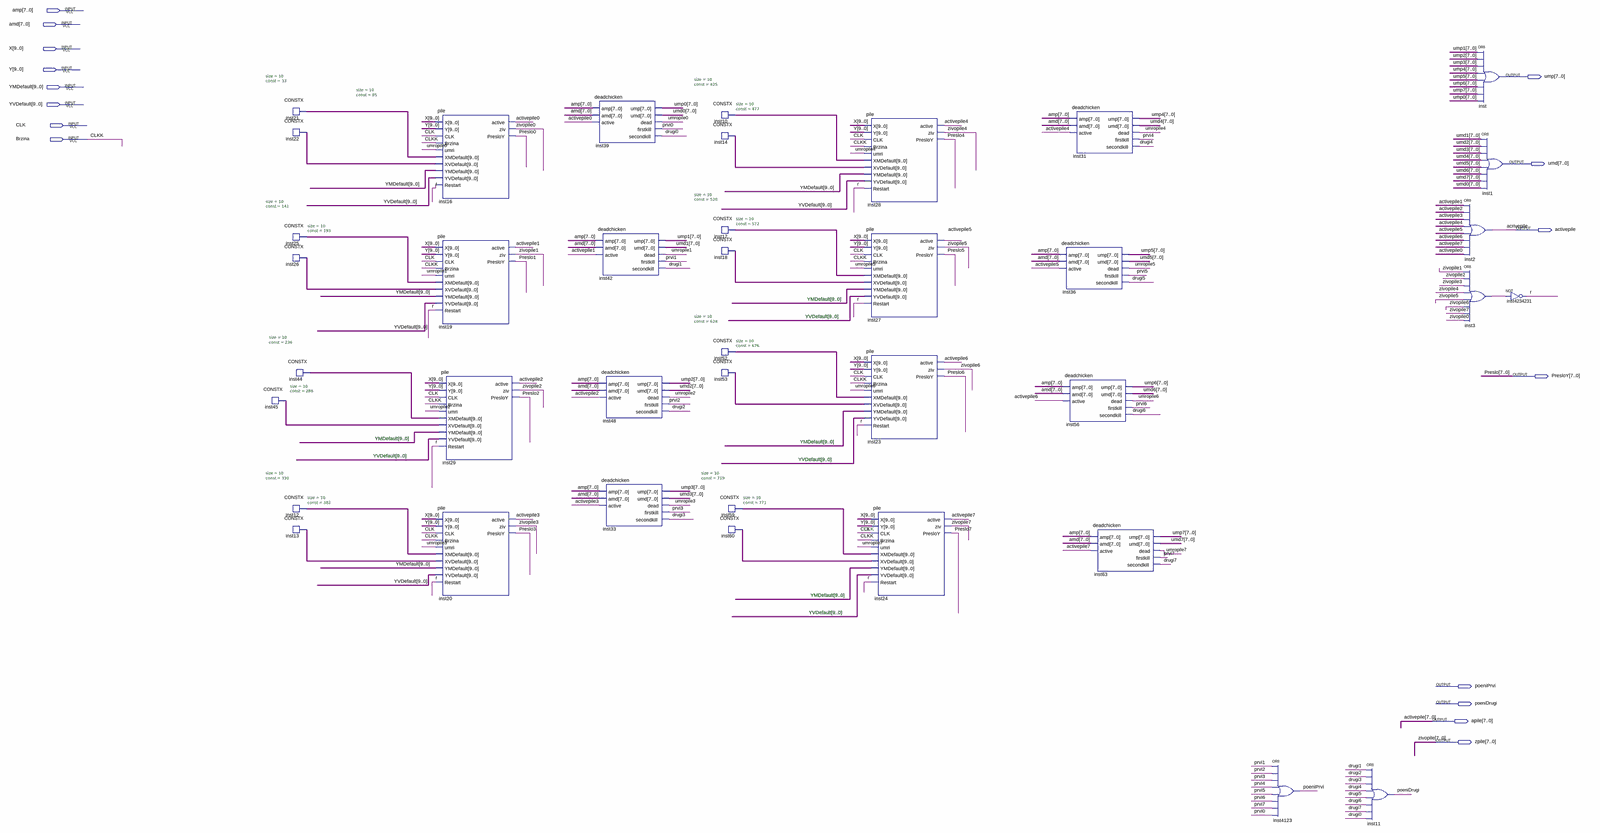
[diagram p0: schematic sheet, whole]
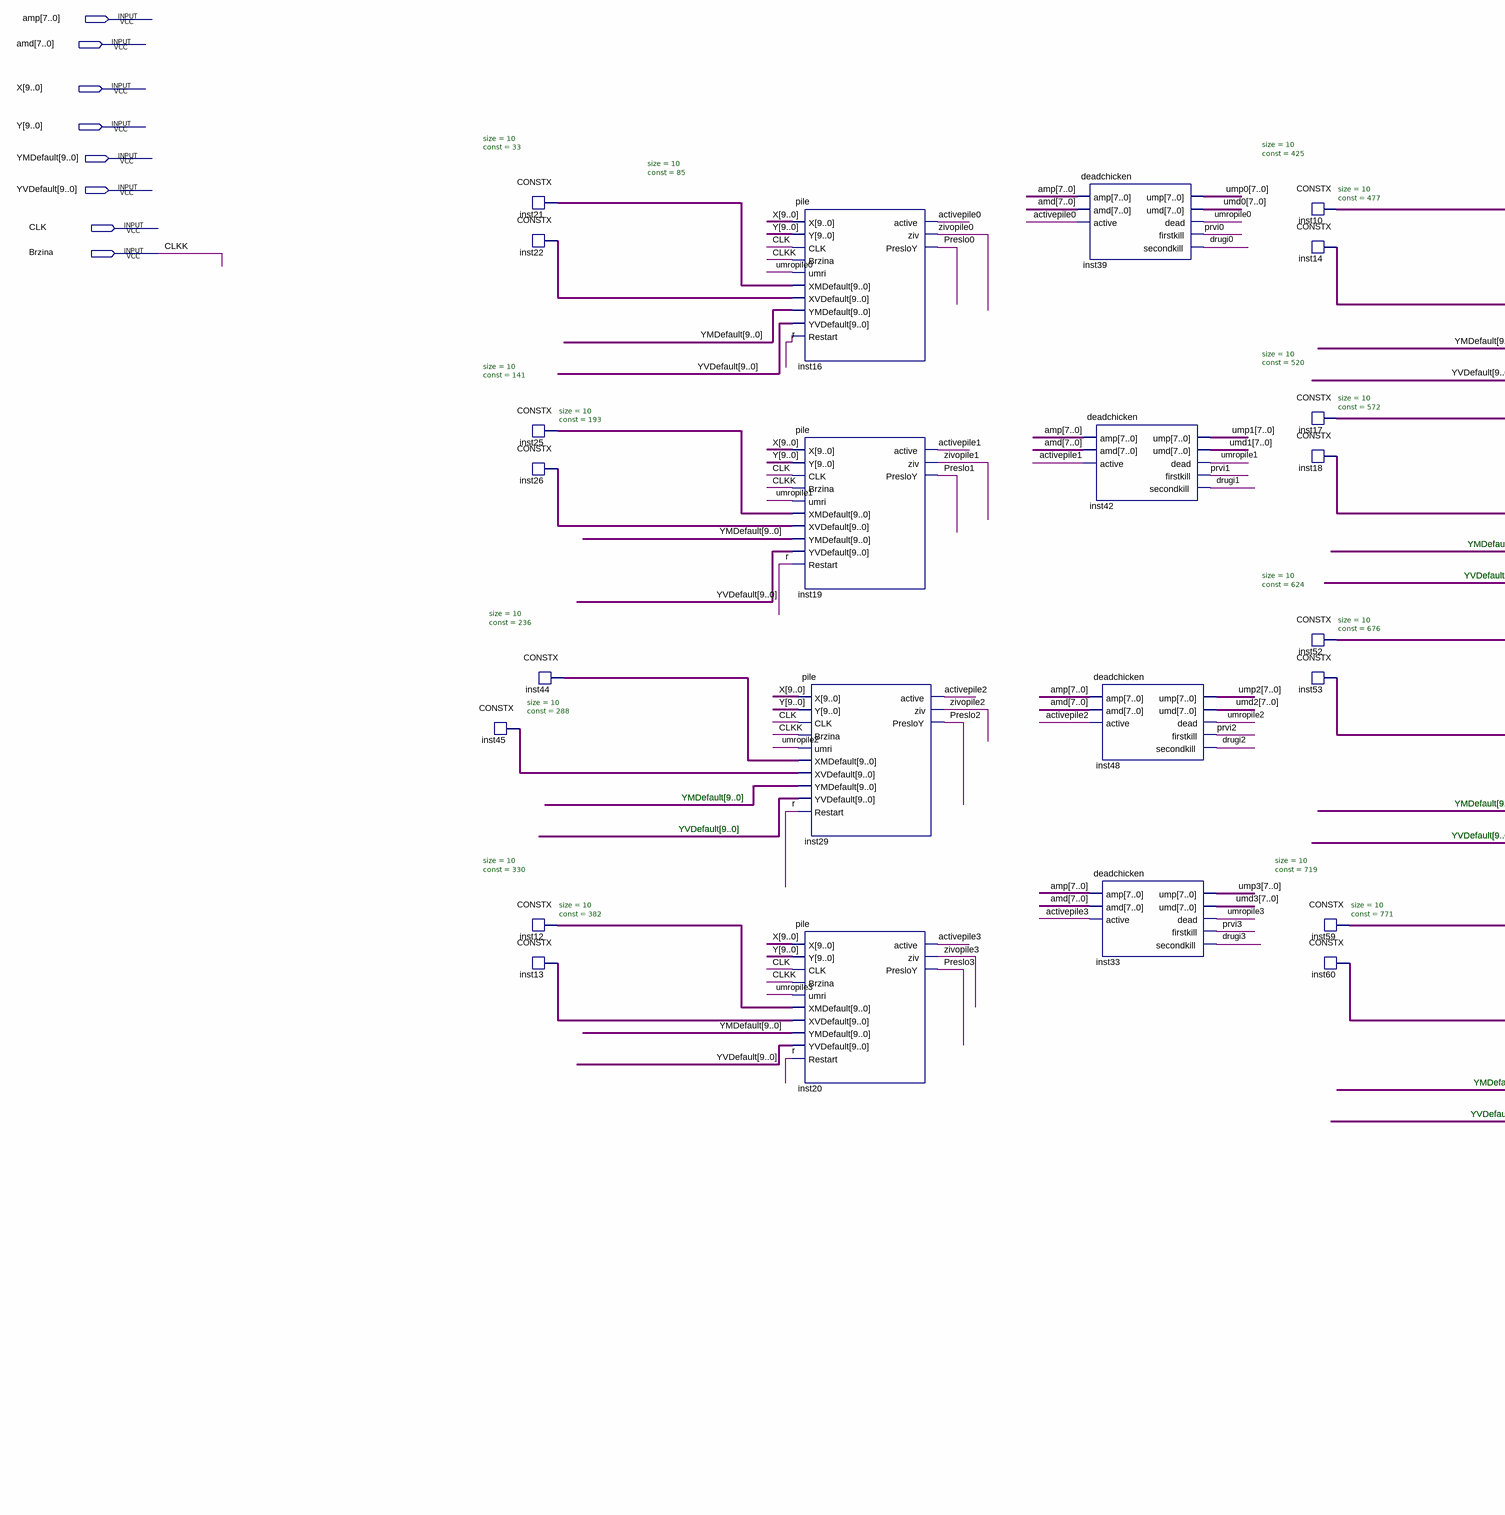
[diagram p1: schematic sheet, left part]
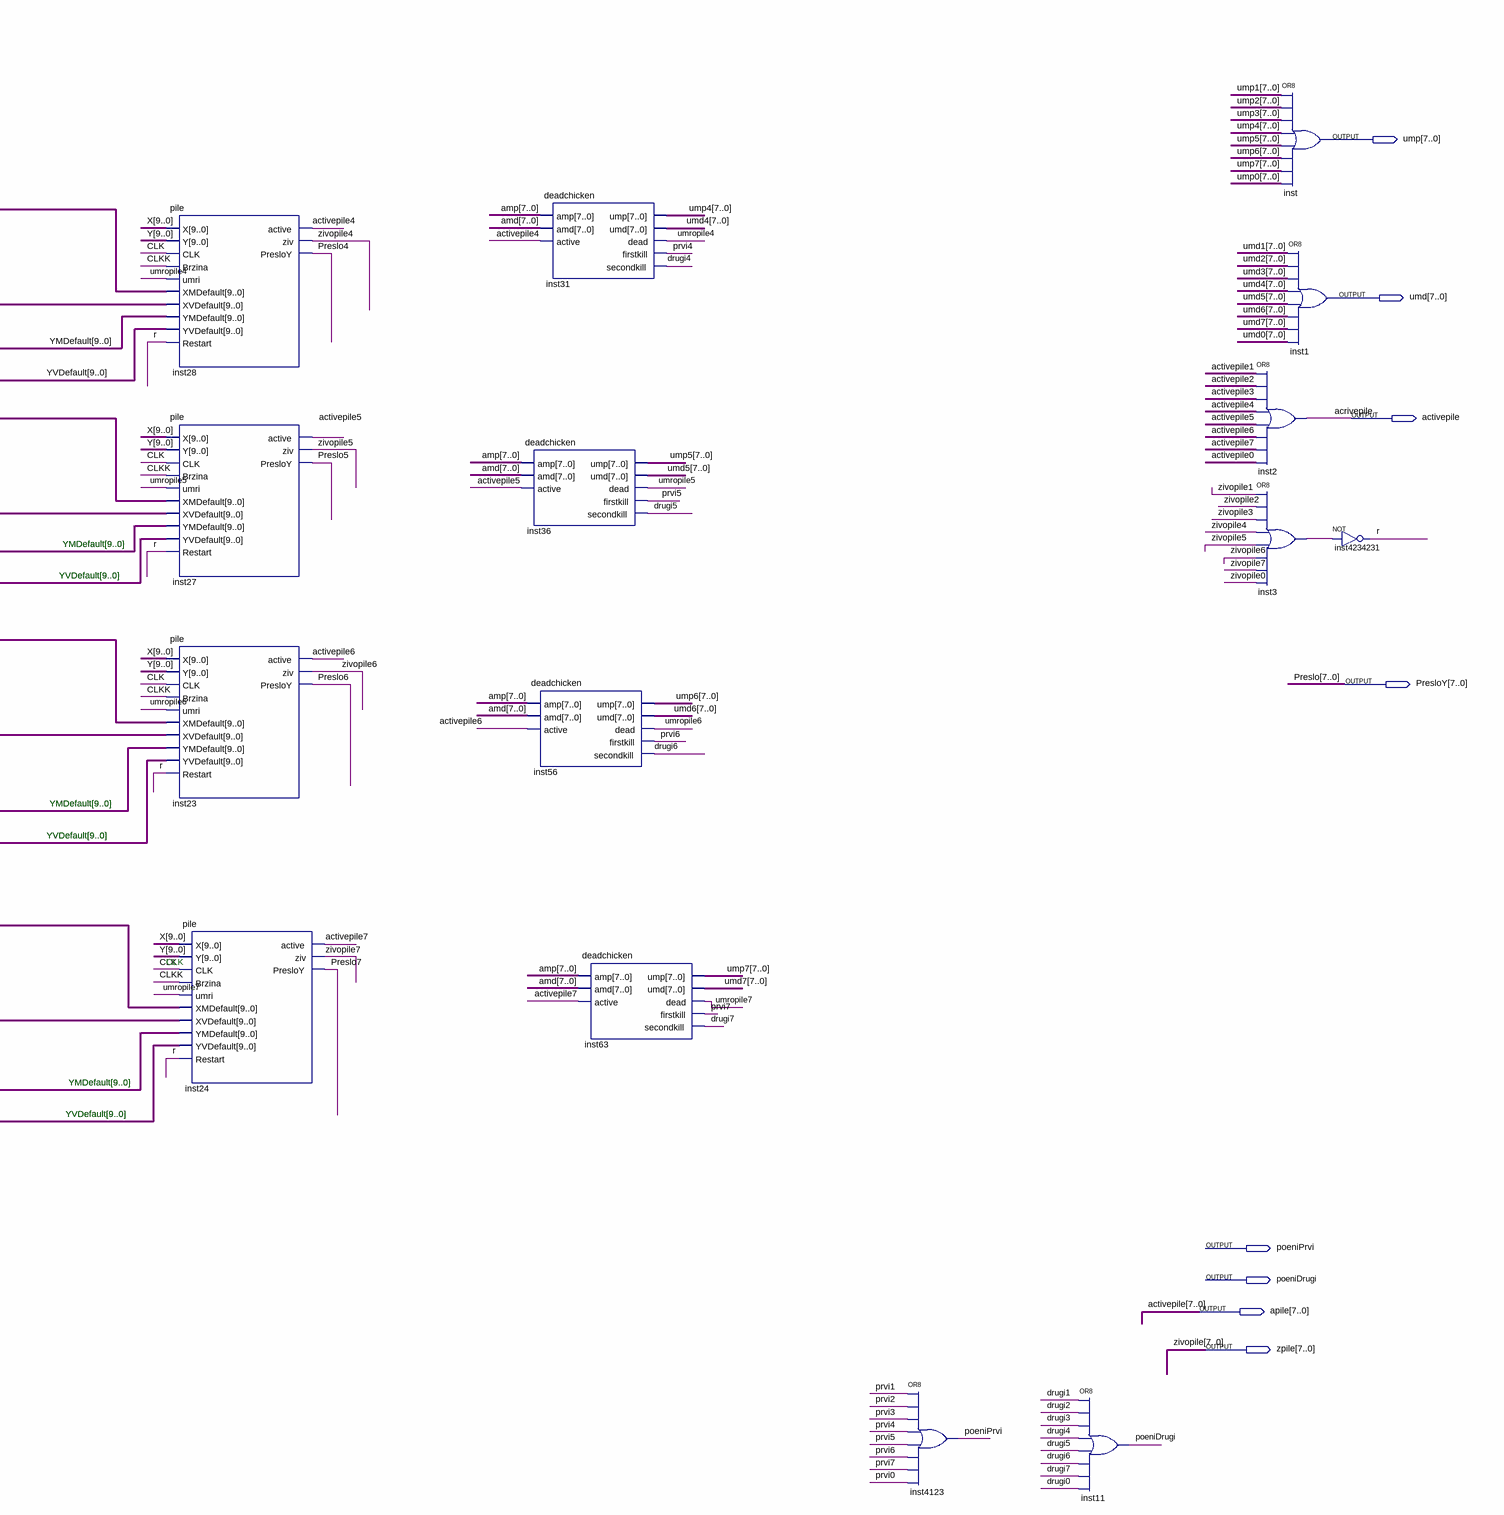
[diagram p2: schematic sheet, right part]
// Quartus schematic Pilici.bdf as structural Verilog: 39 symbols, 16 pins
module Pilici (
  input  [7:0] amp,
  input  [7:0] amd,
  input  [9:0] X,
  input  [9:0] Y,
  input  [9:0] YMDefault,
  input  [9:0] YVDefault,
  input  CLK,
  input  Brzina,
  output [7:0] ump,
  output [7:0] umd,
  output activepile,
  output [7:0] PresloY,
  output poeniPrvi,
  output poeniDrugi,
  output [7:0] apile,
  output [7:0] zpile
);

  wire drugi0, drugi1, drugi2, drugi3, drugi4, drugi5, drugi6, drugi7, inst3_out, prvi0, prvi1, prvi2, prvi3,
       prvi4, prvi5, prvi6, prvi7, r, umropile0, umropile1, umropile2, umropile3, umropile4, umropile5,
       umropile6, umropile7;
  wire [7:0] umd0, umd1, umd2, umd3, umd4, umd5, umd6, umd7, ump0, ump1, ump2, ump3, ump4, ump5, ump6, ump7;
  wire [9:0] inst10_data, inst12_data, inst13_data, inst14_data, inst17_data, inst18_data, inst21_data,
       inst22_data, inst25_data, inst26_data, inst44_data, inst45_data, inst52_data, inst53_data,
       inst59_data, inst60_data;

  CONSTX #(.size(10), .\const (288)) inst45 (.data(inst45_data));
  CONSTX #(.size(10), .\const (33)) inst21 (.data(inst21_data));
  CONSTX #(.size(10), .\const (85)) inst22 (.data(inst22_data));
  CONSTX #(.size(10), .\const (141)) inst25 (.data(inst25_data));
  CONSTX #(.size(10), .\const (193)) inst26 (.data(inst26_data));
  CONSTX #(.size(10), .\const (236)) inst44 (.data(inst44_data));
  CONSTX #(.size(10), .\const (330)) inst12 (.data(inst12_data));
  CONSTX #(.size(10), .\const (382)) inst13 (.data(inst13_data));
  pile inst16 (
    .X(X), .Y(Y), .CLK(CLK), .Brzina(Brzina), .umri(umropile0), .XMDefault(inst21_data),
    .XVDefault(inst22_data), .YMDefault(YMDefault), .YVDefault(YVDefault), .Restart(r), .active(apile[0]),
    .ziv(zpile[0]), .PresloY(PresloY[0]));
  pile inst19 (
    .X(X), .Y(Y), .CLK(CLK), .Brzina(Brzina), .umri(umropile1), .XMDefault(inst25_data),
    .XVDefault(inst26_data), .YMDefault(YMDefault), .YVDefault(YVDefault), .Restart(r), .active(apile[1]),
    .ziv(zpile[1]), .PresloY(PresloY[1]));
  pile inst29 (
    .X(X), .Y(Y), .CLK(CLK), .Brzina(Brzina), .umri(umropile2), .XMDefault(inst44_data),
    .XVDefault(inst45_data), .YMDefault(YMDefault), .YVDefault(YVDefault), .Restart(r), .active(apile[2]),
    .ziv(zpile[2]), .PresloY(PresloY[2]));
  pile inst20 (
    .X(X), .Y(Y), .CLK(CLK), .Brzina(Brzina), .umri(umropile3), .XMDefault(inst12_data),
    .XVDefault(inst13_data), .YMDefault(YMDefault), .YVDefault(YVDefault), .Restart(r), .active(apile[3]),
    .ziv(zpile[3]), .PresloY(PresloY[3]));
  deadchicken inst39 (
    .amp(amp), .amd(amd), .active(apile[0]), .ump(ump0), .umd(umd0), .dead(umropile0), .firstkill(prvi0),
    .secondkill(drugi0));
  deadchicken inst42 (
    .amp(amp), .amd(amd), .active(apile[1]), .ump(ump1), .umd(umd1), .dead(umropile1), .firstkill(prvi1),
    .secondkill(drugi1));
  deadchicken inst48 (
    .amp(amp), .amd(amd), .active(apile[2]), .ump(ump2), .umd(umd2), .dead(umropile2), .firstkill(prvi2),
    .secondkill(drugi2));
  deadchicken inst33 (
    .amp(amp), .amd(amd), .active(apile[3]), .ump(ump3), .umd(umd3), .dead(umropile3), .firstkill(prvi3),
    .secondkill(drugi3));
  CONSTX #(.size(10), .\const (425)) inst10 (.data(inst10_data));
  CONSTX #(.size(10), .\const (477)) inst14 (.data(inst14_data));
  CONSTX #(.size(10), .\const (520)) inst17 (.data(inst17_data));
  CONSTX #(.size(10), .\const (572)) inst18 (.data(inst18_data));
  CONSTX #(.size(10), .\const (624)) inst52 (.data(inst52_data));
  CONSTX #(.size(10), .\const (676)) inst53 (.data(inst53_data));
  CONSTX #(.size(10), .\const (719)) inst59 (.data(inst59_data));
  CONSTX #(.size(10), .\const (771)) inst60 (.data(inst60_data));
  pile inst28 (
    .X(X), .Y(Y), .CLK(CLK), .Brzina(Brzina), .umri(umropile4), .XMDefault(inst10_data),
    .XVDefault(inst14_data), .YMDefault(YMDefault), .YVDefault(YVDefault), .Restart(r), .active(apile[4]),
    .ziv(zpile[4]), .PresloY(PresloY[4]));
  pile inst27 (
    .X(X), .Y(Y), .CLK(CLK), .Brzina(Brzina), .umri(umropile5), .XMDefault(inst17_data),
    .XVDefault(inst18_data), .YMDefault(YMDefault), .YVDefault(YVDefault), .Restart(r), .active(apile[5]),
    .ziv(zpile[5]), .PresloY(PresloY[5]));
  pile inst23 (
    .X(X), .Y(Y), .CLK(CLK), .Brzina(Brzina), .umri(umropile6), .XMDefault(inst52_data),
    .XVDefault(inst53_data), .YMDefault(YMDefault), .YVDefault(YVDefault), .Restart(r), .active(apile[6]),
    .ziv(zpile[6]), .PresloY(PresloY[6]));
  pile inst24 (
    .X(X), .Y(Y), .CLK(CLK), .Brzina(Brzina), .umri(umropile7), .XMDefault(inst59_data),
    .XVDefault(inst60_data), .YMDefault(YMDefault), .YVDefault(YVDefault), .Restart(r), .active(apile[7]),
    .ziv(zpile[7]), .PresloY(PresloY[7]));
  deadchicken inst36 (
    .amp(amp), .amd(amd), .active(apile[5]), .ump(ump5), .umd(umd5), .dead(umropile5), .firstkill(prvi5),
    .secondkill(drugi5));
  deadchicken inst31 (
    .amp(amp), .amd(amd), .active(apile[4]), .ump(ump4), .umd(umd4), .dead(umropile4), .firstkill(prvi4),
    .secondkill(drugi4));
  deadchicken inst56 (
    .amp(amp), .amd(amd), .active(apile[6]), .ump(ump6), .umd(umd6), .dead(umropile6), .firstkill(prvi6),
    .secondkill(drugi6));
  deadchicken inst63 (
    .amp(amp), .amd(amd), .active(apile[7]), .ump(ump7), .umd(umd7), .dead(umropile7), .firstkill(prvi7),
    .secondkill(drugi7));
  or inst4123 (poeniPrvi, prvi1, prvi2, prvi3, prvi4, prvi5, prvi6, prvi7, prvi0);
  or inst11 (poeniDrugi, drugi1, drugi2, drugi3, drugi4, drugi5, drugi6, drugi7, drugi0);
  assign ump = ump1 | ump2 | ump3 | ump4 | ump5 | ump6 | ump7 | ump0;  // OR8 inst, 8 bits wide
  or inst2 (activepile, apile[1], apile[2], apile[3], apile[4], apile[5], apile[6], apile[7], apile[0]);
  or inst3 (inst3_out, zpile[1], zpile[2], zpile[3], zpile[4], zpile[5], zpile[6], zpile[7], zpile[0]);
  assign umd = umd1 | umd2 | umd3 | umd4 | umd5 | umd6 | umd7 | umd0;  // OR8 inst1, 8 bits wide
  not inst4234231 (r, inst3_out);

  // Other names for the same wires on the sheet: acrivepile = activepile; activepile[7:0] = apile;
  //   activepile0 = apile[0]; activepile1 = apile[1]; activepile2 = apile[2]; activepile3 = apile[3];
  //   activepile4 = apile[4]; activepile5 = apile[5]; activepile6 = apile[6]; activepile7 = apile[7]; CLKK = Brzina;
  //   Preslo[7:0] = PresloY; Preslo0 = PresloY[0]; Preslo1 = PresloY[1]; Preslo2 = PresloY[2]; Preslo3 = PresloY[3];
  //   Preslo4 = PresloY[4]; Preslo5 = PresloY[5]; Preslo6 = PresloY[6]; Preslo7 = PresloY[7]; zivopile[7:0] = zpile;
  //   zivopile0 = zpile[0]; zivopile1 = zpile[1]; zivopile2 = zpile[2]; zivopile3 = zpile[3]; zivopile4 = zpile[4];
  //   zivopile5 = zpile[5]; zivopile6 = zpile[6]; zivopile7 = zpile[7]

  // Notes on the sheet:
  //   YMDefault[9..0]
  //   YVDefault[9..0]
  //   YMDefault[9..0]
  //   YMDefault[9..0]
  //   YVDefault[9..0]
  //   YVDefault[9..0]
  //   CLK
  //   YMDefault[9..0]
  //   YVDefault[9..0]
endmodule
